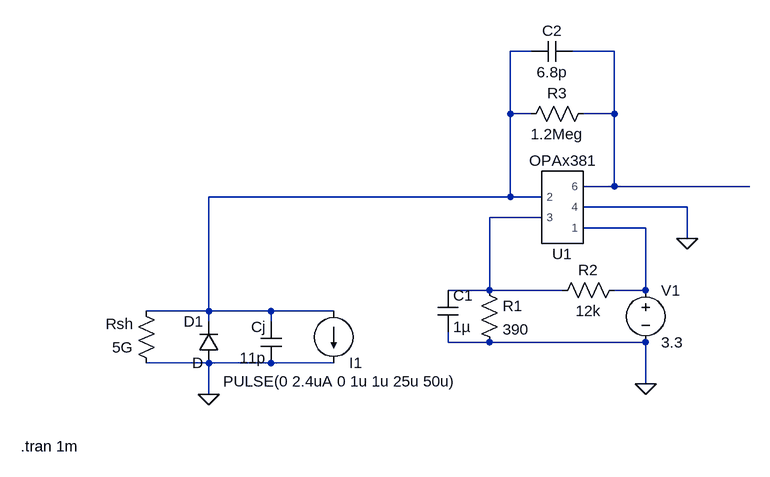
[diagram p0: schematic Photodiode.asc]
Photodiode.asc, the LTspice schematic file:
Version 4.1
SHEET 1 880 680
WIRE 448 -224 416 -224
WIRE 576 -224 512 -224
WIRE 416 -128 416 -224
WIRE 448 -128 416 -128
WIRE 576 -128 576 -224
WIRE 576 -128 528 -128
WIRE 576 -16 576 -128
WIRE 576 -16 528 -16
WIRE 784 -16 576 -16
WIRE 416 0 416 -128
WIRE 416 0 -48 0
WIRE 464 0 416 0
WIRE 688 16 528 16
WIRE 464 32 384 32
WIRE 624 48 528 48
WIRE 688 64 688 16
WIRE 384 144 384 32
WIRE 384 144 320 144
WIRE 496 144 384 144
WIRE 624 144 624 48
WIRE 624 144 576 144
WIRE -48 176 -48 0
WIRE -48 176 -144 176
WIRE 48 176 -48 176
WIRE 144 176 48 176
WIRE -48 192 -48 176
WIRE 48 192 48 176
WIRE 320 224 320 208
WIRE 384 224 320 224
WIRE 624 224 384 224
WIRE -48 256 -144 256
WIRE 48 256 -48 256
WIRE 144 256 48 256
WIRE 624 288 624 224
WIRE -48 304 -48 256
FLAG 624 288 0
FLAG 688 64 0
FLAG -48 304 0
SYMBOL diode -32 256 R180
WINDOW 0 24 64 Left 2
WINDOW 3 24 0 Left 2
SYMATTR InstName D1
SYMBOL cap 64 256 R180
WINDOW 0 24 56 Left 2
WINDOW 3 24 8 Left 2
SYMATTR InstName Cj
SYMATTR Value 11p
SYMBOL res -128 272 R180
WINDOW 0 36 76 Left 2
WINDOW 3 36 40 Left 2
SYMATTR InstName Rsh
SYMATTR Value 5G
SYMBOL current 144 176 R0
WINDOW 0 24 80 Left 2
WINDOW 3 -170 108 Left 2
WINDOW 123 0 0 Left 0
WINDOW 39 0 0 Left 0
SYMATTR InstName I1
SYMATTR Value PULSE(0 2.4uA 0 1u 1u 25u 50u)
SYMBOL OPAx381 496 16 M180
SYMATTR InstName U1
SYMBOL res 368 128 R0
SYMATTR InstName R1
SYMATTR Value 390
SYMBOL res 592 128 R90
WINDOW 0 0 56 VBottom 2
WINDOW 3 32 56 VTop 2
SYMATTR InstName R2
SYMATTR Value 12k
SYMBOL cap 304 144 R0
SYMATTR InstName C1
SYMATTR Value 1µ
SYMBOL voltage 624 128 R0
WINDOW 123 0 0 Left 0
WINDOW 39 0 0 Left 0
SYMATTR InstName V1
SYMATTR Value 3.3
SYMBOL res 544 -144 R90
WINDOW 0 0 56 VBottom 2
WINDOW 3 32 56 VTop 2
SYMATTR InstName R3
SYMATTR Value 1.2Meg
SYMBOL cap 512 -240 R90
WINDOW 0 0 32 VBottom 2
WINDOW 3 32 32 VTop 2
SYMATTR InstName C2
SYMATTR Value 6.8p
TEXT -248 384 Right 2 !.tran 1m

The netlist it stands for:
* Photodiode.asc
D1 0 N001 D
Cj 0 N001 11p
Rsh 0 N001 5G
I1 N001 0 PULSE(0 2.4uA 0 1u 1u 25u 50u)
X§U1 N003 N001 N004 0 N002 OPAx381  ; pins 3 2 1 4 6
R1 N003 0 390
R2 N004 N003 12k
C1 N003 0 1µ
V1 N004 0 3.3
R3 N002 N001 1.2Meg
C2 N002 N001 6.8p
.model D D
.lib standard.dio
.tran 1m
.lib OPAx381.LIB
.backanno
.end